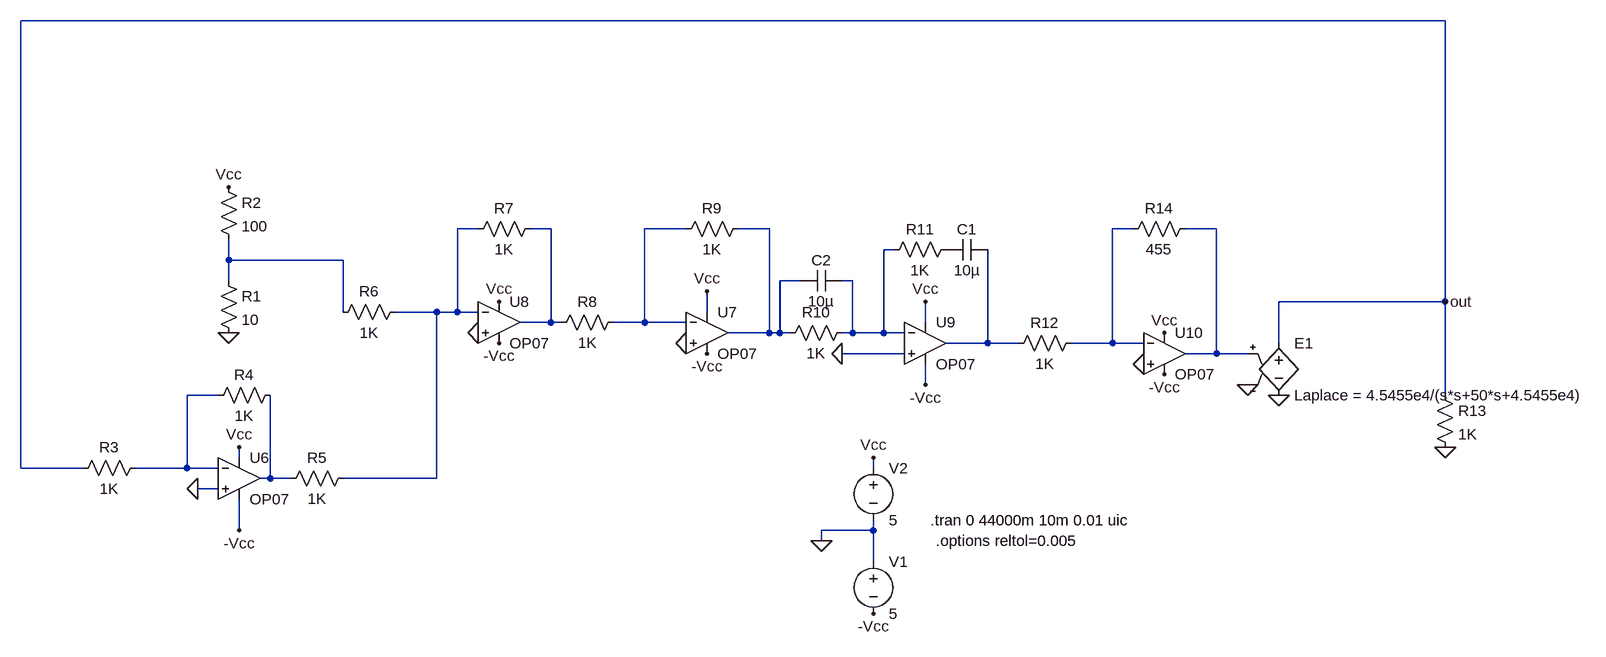
[diagram p0: schematic ActividadRetoTaller5.asc]
ActividadRetoTaller5.asc, the LTspice schematic file:
Version 4.1
SHEET 1 2824 680
WIRE 2528 -688 336 -688
WIRE 1040 -368 1008 -368
WIRE 1152 -368 1120 -368
WIRE 1360 -368 1296 -368
WIRE 1488 -368 1440 -368
WIRE 2048 -368 2016 -368
WIRE 2176 -368 2128 -368
WIRE 1680 -336 1664 -336
WIRE 656 -320 656 -352
WIRE 832 -320 656 -320
WIRE 656 -288 656 -320
WIRE 1536 -288 1504 -288
WIRE 1616 -288 1600 -288
WIRE 2528 -256 2528 -688
WIRE 2528 -256 2272 -256
WIRE 832 -240 832 -320
WIRE 976 -240 912 -240
WIRE 1008 -240 1008 -368
WIRE 1008 -240 976 -240
WIRE 1040 -240 1008 -240
WIRE 1392 -240 1392 -272
WIRE 1152 -224 1152 -368
WIRE 1152 -224 1104 -224
WIRE 1168 -224 1152 -224
WIRE 1296 -224 1296 -368
WIRE 1296 -224 1248 -224
WIRE 1360 -224 1296 -224
WIRE 1728 -224 1728 -256
WIRE 1488 -208 1488 -368
WIRE 1488 -208 1424 -208
WIRE 1504 -208 1504 -288
WIRE 1504 -208 1488 -208
WIRE 1520 -208 1504 -208
WIRE 1616 -208 1616 -288
WIRE 1616 -208 1600 -208
WIRE 1664 -208 1664 -336
WIRE 1664 -208 1616 -208
WIRE 1696 -208 1664 -208
WIRE 1824 -192 1824 -336
WIRE 1824 -192 1760 -192
WIRE 1872 -192 1824 -192
WIRE 2016 -192 2016 -368
WIRE 2016 -192 1952 -192
WIRE 2064 -192 2016 -192
WIRE 2272 -192 2272 -256
WIRE 1696 -176 1600 -176
WIRE 2176 -176 2176 -368
WIRE 2176 -176 2128 -176
WIRE 2224 -176 2176 -176
WIRE 1728 -128 1728 -160
WIRE 640 -112 592 -112
WIRE 2528 -112 2528 -256
WIRE 672 -16 672 -32
WIRE 336 0 336 -688
WIRE 432 0 336 0
WIRE 592 0 592 -112
WIRE 592 0 512 0
WIRE 640 0 592 0
WIRE 1648 0 1648 -16
WIRE 720 16 720 -112
WIRE 720 16 704 16
WIRE 752 16 720 16
WIRE 976 16 976 -240
WIRE 976 16 832 16
WIRE 640 32 608 32
WIRE 672 96 672 48
WIRE 1648 96 1648 80
WIRE 1648 96 1568 96
WIRE 1568 112 1568 96
WIRE 1648 144 1648 96
FLAG 1568 112 0
FLAG 1648 -16 Vcc
FLAG 1648 224 -Vcc
FLAG 656 -208 0
FLAG 656 -432 Vcc
FLAG 672 -32 Vcc
FLAG 1072 -256 Vcc
FLAG 1392 -272 Vcc
FLAG 1728 -256 Vcc
FLAG 2096 -208 Vcc
FLAG 672 96 -Vcc
FLAG 1072 -192 -Vcc
FLAG 1728 -128 -Vcc
FLAG 2096 -144 -Vcc
FLAG 608 32 0
FLAG 1040 -208 0
FLAG 1360 -192 0
FLAG 1600 -176 0
FLAG 2064 -160 0
FLAG 1392 -176 -Vcc
FLAG 2528 -32 0
FLAG 2224 -128 0
FLAG 2272 -112 0
FLAG 2528 -256 out
SYMBOL voltage 1648 128 R0
WINDOW 123 0 0 Left 0
WINDOW 39 0 0 Left 0
SYMATTR InstName V1
SYMATTR Value 5
SYMBOL voltage 1648 -16 R0
WINDOW 123 0 0 Left 0
WINDOW 39 0 0 Left 0
SYMATTR InstName V2
SYMATTR Value 5
SYMBOL res 640 -304 R0
SYMATTR InstName R1
SYMATTR Value 10
SYMBOL res 640 -448 R0
SYMATTR InstName R2
SYMATTR Value 100
SYMBOL res 528 -16 R90
WINDOW 0 0 56 VBottom 2
WINDOW 3 32 56 VTop 2
SYMATTR InstName R3
SYMATTR Value 1K
SYMBOL res 736 -128 R90
WINDOW 0 0 56 VBottom 2
WINDOW 3 32 56 VTop 2
SYMATTR InstName R4
SYMATTR Value 1K
SYMBOL res 848 0 R90
WINDOW 0 0 56 VBottom 2
WINDOW 3 32 56 VTop 2
SYMATTR InstName R5
SYMATTR Value 1K
SYMBOL res 928 -256 R90
WINDOW 0 0 56 VBottom 2
WINDOW 3 32 56 VTop 2
SYMATTR InstName R6
SYMATTR Value 1K
SYMBOL res 1136 -384 R90
WINDOW 0 0 56 VBottom 2
WINDOW 3 32 56 VTop 2
SYMATTR InstName R7
SYMATTR Value 1K
SYMBOL res 1264 -240 R90
WINDOW 0 0 56 VBottom 2
WINDOW 3 32 56 VTop 2
SYMATTR InstName R8
SYMATTR Value 1K
SYMBOL res 1456 -384 R90
WINDOW 0 0 56 VBottom 2
WINDOW 3 32 56 VTop 2
SYMATTR InstName R9
SYMATTR Value 1K
SYMBOL res 1616 -224 R90
WINDOW 0 0 56 VBottom 2
WINDOW 3 32 56 VTop 2
SYMATTR InstName R10
SYMATTR Value 1K
SYMBOL res 1776 -352 R90
WINDOW 0 0 56 VBottom 2
WINDOW 3 32 56 VTop 2
SYMATTR InstName R11
SYMATTR Value 1K
SYMBOL res 1968 -208 R90
WINDOW 0 0 56 VBottom 2
WINDOW 3 32 56 VTop 2
SYMATTR InstName R12
SYMATTR Value 1K
SYMBOL OpAmps\\OP07 672 -48 R0
SYMATTR InstName U6
SYMBOL OpAmps\\OP07 1392 -272 R0
SYMATTR InstName U7
SYMBOL OpAmps\\OP07 1072 -288 R0
SYMATTR InstName U8
SYMBOL OpAmps\\OP07 1728 -256 R0
SYMATTR InstName U9
SYMBOL OpAmps\\OP07 2096 -240 R0
SYMATTR InstName U10
SYMBOL res 2144 -384 R90
WINDOW 0 0 56 VBottom 2
WINDOW 3 32 56 VTop 2
SYMATTR InstName R14
SYMATTR Value 455
SYMBOL res 2512 -128 R0
SYMATTR InstName R13
SYMATTR Value 1K
SYMBOL e 2272 -208 R0
SYMATTR InstName E1
SYMATTR Value Laplace = 4.5455e4/(s*s+50*s+4.5455e4)
SYMBOL cap 1760 -352 M90
WINDOW 0 0 32 VBottom 2
WINDOW 3 32 32 VTop 2
SYMATTR InstName C1
SYMATTR Value 10µ
SYMBOL cap 1536 -304 M90
WINDOW 0 0 32 VBottom 2
WINDOW 3 32 32 VTop 2
SYMATTR InstName C2
SYMATTR Value 10µ
TEXT 1736 80 Left 2 !.tran 0 44000m 10m 0.01 uic
TEXT 1744 112 Left 2 !.options reltol=0.005

The netlist it stands for:
* ActividadRetoTaller5.asc
V1 0 -Vcc 5
V2 Vcc 0 5
R1 N008 0 10
R2 Vcc N008 100
R3 N010 out 1K
R4 N011 N010 1K
R5 N001 N011 1K
R6 N001 N008 1K
R7 N002 N001 1K
R8 N003 N002 1K
R9 N004 N003 1K
R10 N007 N004 1K
R11 P001 N007 1K
R12 N005 N009 1K
X§U6 0 N010 Vcc -Vcc N011 LT1001  ; OP07, pins In+ In- V+ V- OUT
X§U7 0 N003 Vcc -Vcc N004 LT1001  ; OP07, pins In+ In- V+ V- OUT
X§U8 0 N001 Vcc -Vcc N002 LT1001  ; OP07, pins In+ In- V+ V- OUT
X§U9 0 N007 Vcc -Vcc N009 LT1001  ; OP07, pins In+ In- V+ V- OUT
X§U10 0 N005 Vcc -Vcc N006 LT1001  ; OP07, pins In+ In- V+ V- OUT
R14 N006 N005 455
R13 out 0 1K
E1 out 0 N006 0 Laplace = 4.5455e4/(s*s+50*s+4.5455e4)
C1 P001 N009 10µ
C2 N004 N007 10µ
.tran 0 44000m 10m 0.01 uic
.options reltol=0.005
.lib LTC.lib
.backanno
.end